# Altium project Motherboard.PrjPcb
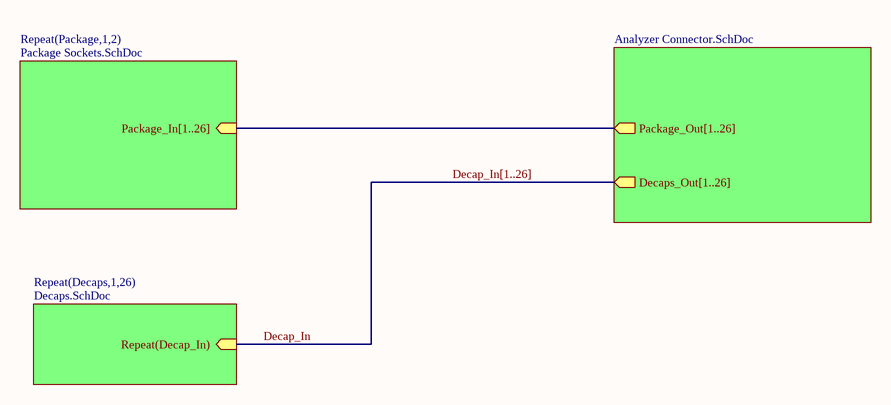
[diagram p0: Main.SchDoc]
5 sheets, 135 parts. Net scope: hierarchical (ports join the sheet entries above them; power ports are global).
Board file: Motherboard.PcbDoc
Sheets:
  Main.SchDoc
    Package1 = Package Sockets.SchDoc
      Resistors1 = Resistors.SchDoc
      Resistors2 = Resistors.SchDoc
      Resistors3 = Resistors.SchDoc
      Resistors4 = Resistors.SchDoc
      Resistors5 = Resistors.SchDoc
      Resistors6 = Resistors.SchDoc
      Resistors7 = Resistors.SchDoc
      Resistors8 = Resistors.SchDoc
      Resistors9 = Resistors.SchDoc
      Resistors10 = Resistors.SchDoc
      Resistors11 = Resistors.SchDoc
      Resistors12 = Resistors.SchDoc
      Resistors13 = Resistors.SchDoc
      Resistors14 = Resistors.SchDoc
      Resistors15 = Resistors.SchDoc
      Resistors16 = Resistors.SchDoc
      Resistors17 = Resistors.SchDoc
      Resistors18 = Resistors.SchDoc
      Resistors19 = Resistors.SchDoc
      Resistors20 = Resistors.SchDoc
      Resistors21 = Resistors.SchDoc
      Resistors22 = Resistors.SchDoc
      Resistors23 = Resistors.SchDoc
      Resistors24 = Resistors.SchDoc
      Resistors25 = Resistors.SchDoc
      Resistors26 = Resistors.SchDoc
    Package2 = Package Sockets.SchDoc
      Resistors1 = Resistors.SchDoc
      Resistors2 = Resistors.SchDoc
      Resistors3 = Resistors.SchDoc
      Resistors4 = Resistors.SchDoc
      Resistors5 = Resistors.SchDoc
      Resistors6 = Resistors.SchDoc
      Resistors7 = Resistors.SchDoc
      Resistors8 = Resistors.SchDoc
      Resistors9 = Resistors.SchDoc
      Resistors10 = Resistors.SchDoc
      Resistors11 = Resistors.SchDoc
      Resistors12 = Resistors.SchDoc
      Resistors13 = Resistors.SchDoc
      Resistors14 = Resistors.SchDoc
      Resistors15 = Resistors.SchDoc
      Resistors16 = Resistors.SchDoc
      Resistors17 = Resistors.SchDoc
      Resistors18 = Resistors.SchDoc
      Resistors19 = Resistors.SchDoc
      Resistors20 = Resistors.SchDoc
      Resistors21 = Resistors.SchDoc
      Resistors22 = Resistors.SchDoc
      Resistors23 = Resistors.SchDoc
      Resistors24 = Resistors.SchDoc
      Resistors25 = Resistors.SchDoc
      Resistors26 = Resistors.SchDoc
     = Analyzer Connector.SchDoc
    Decaps1 = Decaps.SchDoc
    Decaps2 = Decaps.SchDoc
    Decaps3 = Decaps.SchDoc
    Decaps4 = Decaps.SchDoc
    Decaps5 = Decaps.SchDoc
    Decaps6 = Decaps.SchDoc
    Decaps7 = Decaps.SchDoc
    Decaps8 = Decaps.SchDoc
    Decaps9 = Decaps.SchDoc
    Decaps10 = Decaps.SchDoc
    Decaps11 = Decaps.SchDoc
    Decaps12 = Decaps.SchDoc
    Decaps13 = Decaps.SchDoc
    Decaps14 = Decaps.SchDoc
    Decaps15 = Decaps.SchDoc
    Decaps16 = Decaps.SchDoc
    Decaps17 = Decaps.SchDoc
    Decaps18 = Decaps.SchDoc
    Decaps19 = Decaps.SchDoc
    Decaps20 = Decaps.SchDoc
    Decaps21 = Decaps.SchDoc
    Decaps22 = Decaps.SchDoc
    Decaps23 = Decaps.SchDoc
    Decaps24 = Decaps.SchDoc
    Decaps25 = Decaps.SchDoc
    Decaps26 = Decaps.SchDoc

## Sheet Main.SchDoc
size A; SheetNumber: 1; SheetTotal: 5

### Sub-sheets
Repeat(Decaps,1,26) = Decaps.SchDoc: Repeat(Decap_In) (in)
Repeat(Package,1,2) = Package Sockets.SchDoc: Package_In[1..26] (in)
? = Analyzer Connector.SchDoc: Package_Out[1..26] (out), Decaps_Out[1..26] (out)

### Buses and harness runs
bus Decap_In[1..26] = sheet /Decaps_Out[1..26]
bus sheet /Package_Out[1..26] = sheet Repeat(Package,1,2)/Package_In[1..26]

## Sheet Package Sockets.SchDoc
size A; SheetNumber: 3; SheetTotal: 5
Used 2 times, as channels Package1, Package2. Parts and nets are listed once, with the designators drawn on the sheet.
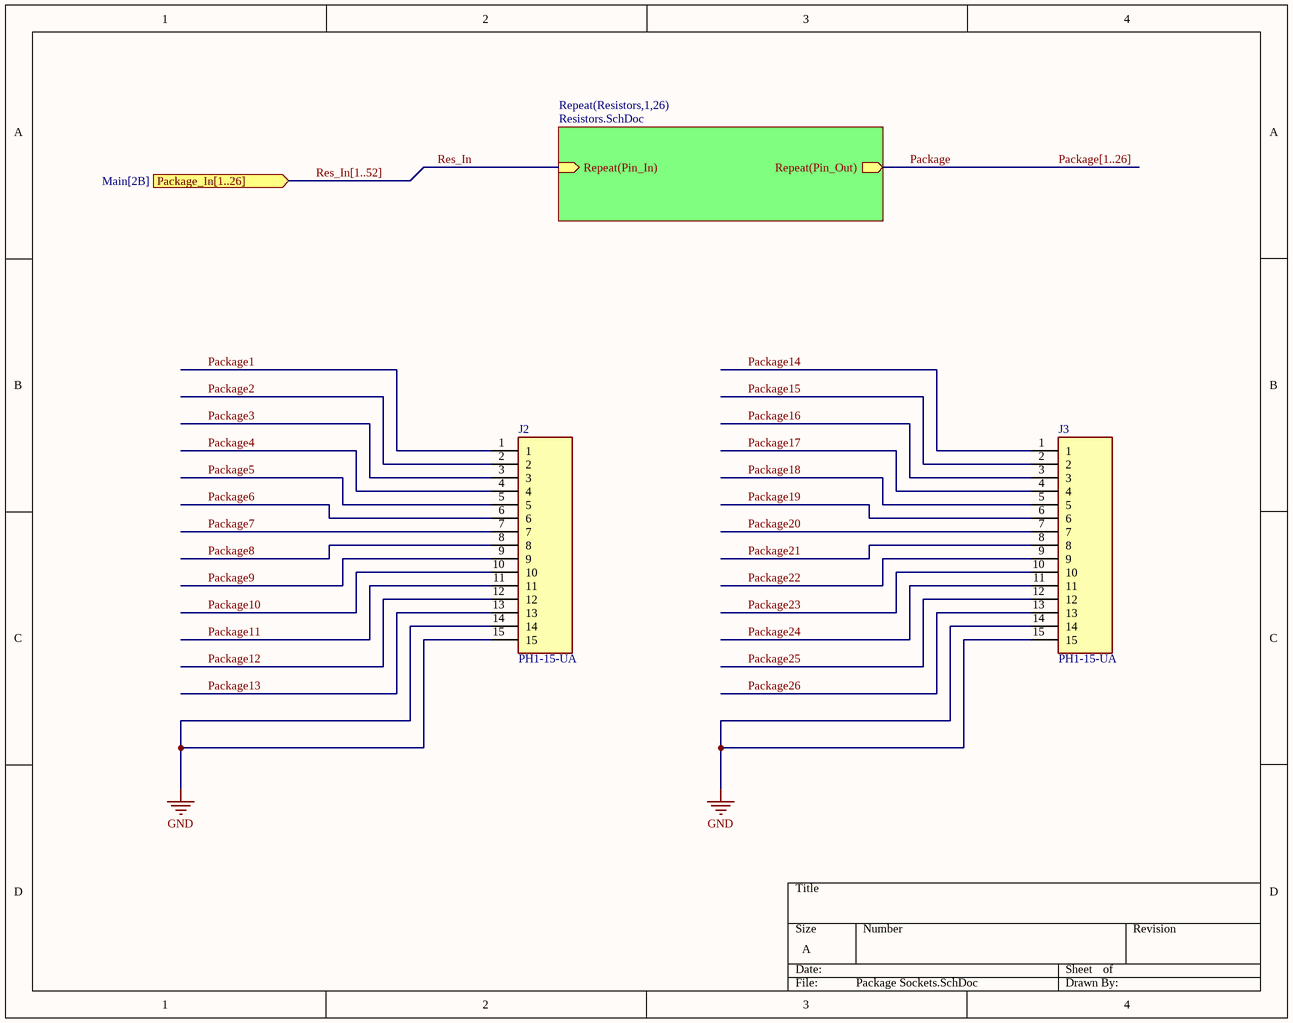
[diagram p1: Package Sockets.SchDoc]

### Parts
J2  PH1-15-UA  [HDRV15W64P0X254_1X15_3810X249X886P]
J3  PH1-15-UA  [HDRV15W64P0X254_1X15_3810X249X886P]

### Sub-sheets
Repeat(Resistors,1,26) = Resistors.SchDoc: Repeat(Pin_In) (in), Repeat(Pin_Out) (out)

### Ports
Package_In[1..26] (in, see Main[2B])

### Nets
GND: J2.14 J2.15 J3.14 J3.15
Package: sheet Repeat(Resistors,1,26)/Repeat(Pin_Out)
Package1: J2.1
Package2: J2.2
Package3: J2.3
Package4: J2.4
Package5: J2.5
Package6: J2.6
Package7: J2.7
Package8: J2.8
Package9: J2.9
Package10: J2.10
Package11: J2.11
Package12: J2.12
Package13: J2.13
Package14: J3.1
Package15: J3.2
Package16: J3.3
Package17: J3.4
Package18: J3.5
Package19: J3.6
Package20: J3.7
Package21: J3.8
Package22: J3.9
Package23: J3.10
Package24: J3.11
Package25: J3.12
Package26: J3.13
Res_In: sheet Repeat(Resistors,1,26)/Repeat(Pin_In)

### Channels
Package1: designators end in _Package1
Package2: designators end in _Package2

### Buses and harness runs
bus Package[1..26]
bus Res_In[1..52] = port Package_In[1..26]

### Library data of the parts
J2 J3 = PH1-15-UA: Connector; Manufacturer_Name: Adam Tech; Datasheet Link: https://app.adam-tech.com/products/download/data_sheet/201605/ph1-xx-ua-data-sheet.pdf; Height: 8.865mm; Manufacturer_Part_Number: PH1-15-UA; Mouser Part Number: 737-PH1-15-UA; Mouser Price/Stock: https://www.mouser.co.uk/ProductDetail/Adam-Tech/PH1-15-UA?qs=HoCaDK9Nz5dUS47ZXPBTBg%3D%3D; Arrow Part Number: PH1-15-UA; Arrow Price/Stock: https://www.arrow.com/en/products/ph1-15-ua/adam-tech?region=nac

## Sheet Resistors.SchDoc
size A; SheetNumber: 4; SheetTotal: 5
Used 52 times, as channels Package1/Resistors1, Package1/Resistors2, Package1/Resistors3, Package1/Resistors4, Package1/Resistors5, Package1/Resistors6, Package1/Resistors7, Package1/Resistors8, Package1/Resistors9, Package1/Resistors10, Package1/Resistors11, Package1/Resistors12, Package1/Resistors13, Package1/Resistors14, Package1/Resistors15, Package1/Resistors16, Package1/Resistors17, Package1/Resistors18, Package1/Resistors19, Package1/Resistors20, Package1/Resistors21, Package1/Resistors22, Package1/Resistors23, Package1/Resistors24, Package1/Resistors25, Package1/Resistors26, Package2/Resistors1, Package2/Resistors2, Package2/Resistors3, Package2/Resistors4, Package2/Resistors5, Package2/Resistors6, Package2/Resistors7, Package2/Resistors8, Package2/Resistors9, Package2/Resistors10, Package2/Resistors11, Package2/Resistors12, Package2/Resistors13, Package2/Resistors14, Package2/Resistors15, Package2/Resistors16, Package2/Resistors17, Package2/Resistors18, Package2/Resistors19, Package2/Resistors20, Package2/Resistors21, Package2/Resistors22, Package2/Resistors23, Package2/Resistors24, Package2/Resistors25, Package2/Resistors26. Parts and nets are listed once, with the designators drawn on the sheet.
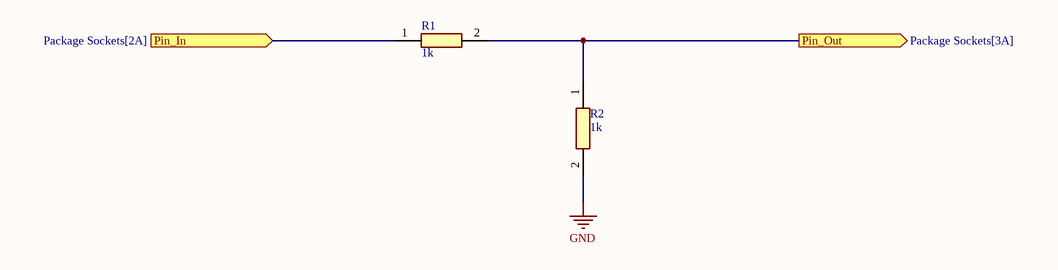
[diagram p2: Resistors.SchDoc]

### Parts
R1  1k  [RESC1608X55N]
R2  1k  [RESC1608X55N]

### Ports
Pin_In (in, see Package Sockets[2A]), Pin_Out (out, see Package Sockets[3A])

### Nets
GND: R2.2
Pin_In: R1.1 ; port Pin_In
Pin_Out: R1.2 R2.1 ; port Pin_Out

### Channels
Package1/Resistors1: designators end in _Resistors1; ports Pin_In=Decap_In1 Pin_Out=Package1_Package1
Package1/Resistors2: designators end in _Resistors2; ports Pin_In=Decap_In2 Pin_Out=Package2_Package1
Package1/Resistors3: designators end in _Resistors3; ports Pin_In=Decap_In3 Pin_Out=Package3_Package1
Package1/Resistors4: designators end in _Resistors4; ports Pin_In=Decap_In4 Pin_Out=Package4_Package1
Package1/Resistors5: designators end in _Resistors5; ports Pin_In=Decap_In5 Pin_Out=Package5_Package1
Package1/Resistors6: designators end in _Resistors6; ports Pin_In=Decap_In6 Pin_Out=Package6_Package1
Package1/Resistors7: designators end in _Resistors7; ports Pin_In=Decap_In7 Pin_Out=Package7_Package1
Package1/Resistors8: designators end in _Resistors8; ports Pin_In=Decap_In8 Pin_Out=Package8_Package1
Package1/Resistors9: designators end in _Resistors9; ports Pin_In=Decap_In9 Pin_Out=Package9_Package1
Package1/Resistors10: designators end in _Resistors10; ports Pin_In=Decap_In10 Pin_Out=Package10_Package1
Package1/Resistors11: designators end in _Resistors11; ports Pin_In=Decap_In11 Pin_Out=Package11_Package1
Package1/Resistors12: designators end in _Resistors12; ports Pin_In=Decap_In12 Pin_Out=Package12_Package1
Package1/Resistors13: designators end in _Resistors13; ports Pin_In=Decap_In13 Pin_Out=Package13_Package1
Package1/Resistors14: designators end in _Resistors14; ports Pin_In=Decap_In14 Pin_Out=Package14_Package1
Package1/Resistors15: designators end in _Resistors15; ports Pin_In=Decap_In15 Pin_Out=Package15_Package1
Package1/Resistors16: designators end in _Resistors16; ports Pin_In=Decap_In16 Pin_Out=Package16_Package1
Package1/Resistors17: designators end in _Resistors17; ports Pin_In=Decap_In17 Pin_Out=Package17_Package1
Package1/Resistors18: designators end in _Resistors18; ports Pin_In=Decap_In18 Pin_Out=Package18_Package1
Package1/Resistors19: designators end in _Resistors19; ports Pin_In=Decap_In19 Pin_Out=Package19_Package1
Package1/Resistors20: designators end in _Resistors20; ports Pin_In=Decap_In20 Pin_Out=Package20_Package1
Package1/Resistors21: designators end in _Resistors21; ports Pin_In=Decap_In21 Pin_Out=Package21_Package1
Package1/Resistors22: designators end in _Resistors22; ports Pin_In=Decap_In22 Pin_Out=Package22_Package1
Package1/Resistors23: designators end in _Resistors23; ports Pin_In=Decap_In23 Pin_Out=Package23_Package1
Package1/Resistors24: designators end in _Resistors24; ports Pin_In=Decap_In24 Pin_Out=Package24_Package1
Package1/Resistors25: designators end in _Resistors25; ports Pin_In=Decap_In25 Pin_Out=Package25_Package1
Package1/Resistors26: designators end in _Resistors26; ports Pin_In=Decap_In26 Pin_Out=Package26_Package1
Package2/Resistors1: designators end in _Resistors27; ports Pin_In=Decap_In1 Pin_Out=Package1_Package2
Package2/Resistors2: designators end in _Resistors28; ports Pin_In=Decap_In2 Pin_Out=Package2_Package2
Package2/Resistors3: designators end in _Resistors29; ports Pin_In=Decap_In3 Pin_Out=Package3_Package2
Package2/Resistors4: designators end in _Resistors30; ports Pin_In=Decap_In4 Pin_Out=Package4_Package2
Package2/Resistors5: designators end in _Resistors31; ports Pin_In=Decap_In5 Pin_Out=Package5_Package2
Package2/Resistors6: designators end in _Resistors32; ports Pin_In=Decap_In6 Pin_Out=Package6_Package2
Package2/Resistors7: designators end in _Resistors33; ports Pin_In=Decap_In7 Pin_Out=Package7_Package2
Package2/Resistors8: designators end in _Resistors34; ports Pin_In=Decap_In8 Pin_Out=Package8_Package2
Package2/Resistors9: designators end in _Resistors35; ports Pin_In=Decap_In9 Pin_Out=Package9_Package2
Package2/Resistors10: designators end in _Resistors36; ports Pin_In=Decap_In10 Pin_Out=Package10_Package2
Package2/Resistors11: designators end in _Resistors37; ports Pin_In=Decap_In11 Pin_Out=Package11_Package2
Package2/Resistors12: designators end in _Resistors38; ports Pin_In=Decap_In12 Pin_Out=Package12_Package2
Package2/Resistors13: designators end in _Resistors39; ports Pin_In=Decap_In13 Pin_Out=Package13_Package2
Package2/Resistors14: designators end in _Resistors40; ports Pin_In=Decap_In14 Pin_Out=Package14_Package2
Package2/Resistors15: designators end in _Resistors41; ports Pin_In=Decap_In15 Pin_Out=Package15_Package2
Package2/Resistors16: designators end in _Resistors42; ports Pin_In=Decap_In16 Pin_Out=Package16_Package2
Package2/Resistors17: designators end in _Resistors43; ports Pin_In=Decap_In17 Pin_Out=Package17_Package2
Package2/Resistors18: designators end in _Resistors44; ports Pin_In=Decap_In18 Pin_Out=Package18_Package2
Package2/Resistors19: designators end in _Resistors45; ports Pin_In=Decap_In19 Pin_Out=Package19_Package2
Package2/Resistors20: designators end in _Resistors46; ports Pin_In=Decap_In20 Pin_Out=Package20_Package2
Package2/Resistors21: designators end in _Resistors47; ports Pin_In=Decap_In21 Pin_Out=Package21_Package2
Package2/Resistors22: designators end in _Resistors48; ports Pin_In=Decap_In22 Pin_Out=Package22_Package2
Package2/Resistors23: designators end in _Resistors49; ports Pin_In=Decap_In23 Pin_Out=Package23_Package2
Package2/Resistors24: designators end in _Resistors50; ports Pin_In=Decap_In24 Pin_Out=Package24_Package2
Package2/Resistors25: designators end in _Resistors51; ports Pin_In=Decap_In25 Pin_Out=Package25_Package2
Package2/Resistors26: designators end in _Resistors52; ports Pin_In=Decap_In26 Pin_Out=Package26_Package2

### Library data of the parts
R1 R2 = RMCF0603FT1K00: Manufacturer_Name: Stackpole Electronics; Datasheet Link: https://www.seielect.com/Catalog/SEI-RMCF_RMCP.pdf; Height: 0.55mm; Manufacturer_Part_Number: RMCF0603FT1K00; Mouser Part Number: 708-RMCF0603FT1K00; Mouser Price/Stock: https://www.mouser.co.uk/ProductDetail/SEI-Stackpole/RMCF0603FT1K00?qs=FESYatJ8odI%252BYiPlprc1Pg%3D%3D; Arrow Part Number: RMCF0603FT1K00; Arrow Price/Stock: https://www.arrow.com/en/products/rmcf0603ft1k00/stackpole-electronics?utm_currency=USD&region=nac

## Sheet Analyzer Connector.SchDoc
size A; SheetNumber: 2; SheetTotal: 5
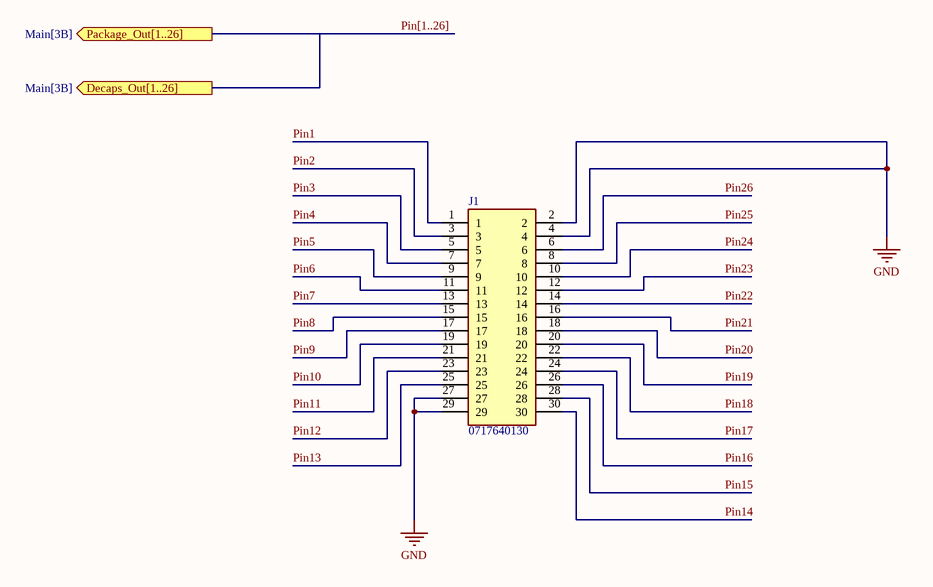
[diagram p3: Analyzer Connector.SchDoc]

### Parts
J1  0717640130  [HDRRA30W64P254_2X15_3810X229X533P]

### Ports
Decaps_Out[1..26] (out, see Main[3B]), Package_Out[1..26] (out, see Main[3B])

### Nets
GND: J1.2 J1.4 J1.27 J1.29
Pin1: J1.1  [project net Decap_In1]
Pin2: J1.3  [project net Decap_In2]
Pin3: J1.5  [project net Decap_In3]
Pin4: J1.7  [project net Decap_In4]
Pin5: J1.9  [project net Decap_In5]
Pin6: J1.11  [project net Decap_In6]
Pin7: J1.13  [project net Decap_In7]
Pin8: J1.15  [project net Decap_In8]
Pin9: J1.17  [project net Decap_In9]
Pin10: J1.19  [project net Decap_In10]
Pin11: J1.21  [project net Decap_In11]
Pin12: J1.23  [project net Decap_In12]
Pin13: J1.25  [project net Decap_In13]
Pin14: J1.30  [project net Decap_In14]
Pin15: J1.28  [project net Decap_In15]
Pin16: J1.26  [project net Decap_In16]
Pin17: J1.24  [project net Decap_In17]
Pin18: J1.22  [project net Decap_In18]
Pin19: J1.20  [project net Decap_In19]
Pin20: J1.18  [project net Decap_In20]
Pin21: J1.16  [project net Decap_In21]
Pin22: J1.14  [project net Decap_In22]
Pin23: J1.12  [project net Decap_In23]
Pin24: J1.10  [project net Decap_In24]
Pin25: J1.8  [project net Decap_In25]
Pin26: J1.6  [project net Decap_In26]

### Buses and harness runs
bus Pin[1..26] = port Decaps_Out[1..26] = port Package_Out[1..26]

### Library data of the parts
J1 = 0717640130: Connector; Manufacturer_Name: Molex; Datasheet Link: https://www.molex.com/pdm_docs/sd/717640130_sd.pdf; Height: 5.33mm; Manufacturer_Part_Number: 0717640130; Mouser Part Number: N/A; Mouser Price/Stock: https://www.mouser.com/Search/Refine.aspx?Keyword=N%2FA; Arrow Part Number: 0717640130; Arrow Price/Stock: https://www.arrow.com/en/products/0717640130/molex

## Sheet Decaps.SchDoc
size A; SheetNumber: 5; SheetTotal: 5
Used 26 times, as channels Decaps1, Decaps2, Decaps3, Decaps4, Decaps5, Decaps6, Decaps7, Decaps8, Decaps9, Decaps10, Decaps11, Decaps12, Decaps13, Decaps14, Decaps15, Decaps16, Decaps17, Decaps18, Decaps19, Decaps20, Decaps21, Decaps22, Decaps23, Decaps24, Decaps25, Decaps26. Parts and nets are listed once, with the designators drawn on the sheet.
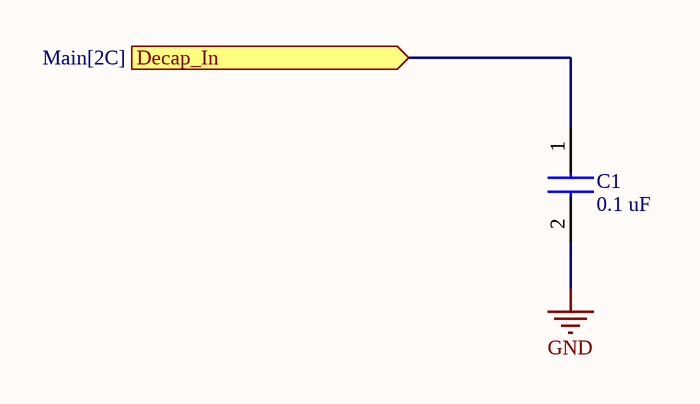
[diagram p4: Decaps.SchDoc]

### Parts
C1  0.1 uF  [C0603]

### Ports
Decap_In (in, see Main[2C])

### Nets
GND: C1.2
Decap_In: C1.1 ; port Decap_In

### Channels
Decaps1: designators end in _Decaps1; ports Decap_In=Decap_In1
Decaps2: designators end in _Decaps2; ports Decap_In=Decap_In2
Decaps3: designators end in _Decaps3; ports Decap_In=Decap_In3
Decaps4: designators end in _Decaps4; ports Decap_In=Decap_In4
Decaps5: designators end in _Decaps5; ports Decap_In=Decap_In5
Decaps6: designators end in _Decaps6; ports Decap_In=Decap_In6
Decaps7: designators end in _Decaps7; ports Decap_In=Decap_In7
Decaps8: designators end in _Decaps8; ports Decap_In=Decap_In8
Decaps9: designators end in _Decaps9; ports Decap_In=Decap_In9
Decaps10: designators end in _Decaps10; ports Decap_In=Decap_In10
Decaps11: designators end in _Decaps11; ports Decap_In=Decap_In11
Decaps12: designators end in _Decaps12; ports Decap_In=Decap_In12
Decaps13: designators end in _Decaps13; ports Decap_In=Decap_In13
Decaps14: designators end in _Decaps14; ports Decap_In=Decap_In14
Decaps15: designators end in _Decaps15; ports Decap_In=Decap_In15
Decaps16: designators end in _Decaps16; ports Decap_In=Decap_In16
Decaps17: designators end in _Decaps17; ports Decap_In=Decap_In17
Decaps18: designators end in _Decaps18; ports Decap_In=Decap_In18
Decaps19: designators end in _Decaps19; ports Decap_In=Decap_In19
Decaps20: designators end in _Decaps20; ports Decap_In=Decap_In20
Decaps21: designators end in _Decaps21; ports Decap_In=Decap_In21
Decaps22: designators end in _Decaps22; ports Decap_In=Decap_In22
Decaps23: designators end in _Decaps23; ports Decap_In=Decap_In23
Decaps24: designators end in _Decaps24; ports Decap_In=Decap_In24
Decaps25: designators end in _Decaps25; ports Decap_In=Decap_In25
Decaps26: designators end in _Decaps26; ports Decap_In=Decap_In26

### Library data of the parts
C1 = C0603C104K5RAC7411: Manufacturer_Name: KEMET; Datasheet Link: https://content.kemet.com/datasheets/KEM_C1002_X7R_SMD.pdf; Height: 0.87mm; Manufacturer_Part_Number: C0603C104K5RAC7411; Mouser Part Number: 80-C0603C104K5R7411; Mouser Price/Stock: https://www.mouser.co.uk/ProductDetail/KEMET/C0603C104K5RAC7411?qs=JxH5GSBHSCRTO9iUpWbJFg%3D%3D; Arrow Part Number: C0603C104K5RAC7411; Arrow Price/Stock: https://www.arrow.com/en/products/c0603c104k5rac7411/kemet-corporation?region=nac

## Nets that join several sheets
GND: Package1 (J2_Package1.14 J2_Package1.15 J3_Package1.14 J3_Package1.15), Package1/Resistors1 (R2_Resistors1.2), Package1/Resistors2 (R2_Resistors2.2), Package1/Resistors3 (R2_Resistors3.2), Package1/Resistors4 (R2_Resistors4.2), Package1/Resistors5 (R2_Resistors5.2), Package1/Resistors6 (R2_Resistors6.2), Package1/Resistors7 (R2_Resistors7.2), Package1/Resistors8 (R2_Resistors8.2), Package1/Resistors9 (R2_Resistors9.2), Package1/Resistors10 (R2_Resistors10.2), Package1/Resistors11 (R2_Resistors11.2), Package1/Resistors12 (R2_Resistors12.2), Package1/Resistors13 (R2_Resistors13.2), Package1/Resistors14 (R2_Resistors14.2), Package1/Resistors15 (R2_Resistors15.2), Package1/Resistors16 (R2_Resistors16.2), Package1/Resistors17 (R2_Resistors17.2), Package1/Resistors18 (R2_Resistors18.2), Package1/Resistors19 (R2_Resistors19.2), Package1/Resistors20 (R2_Resistors20.2), Package1/Resistors21 (R2_Resistors21.2), Package1/Resistors22 (R2_Resistors22.2), Package1/Resistors23 (R2_Resistors23.2), Package1/Resistors24 (R2_Resistors24.2), Package1/Resistors25 (R2_Resistors25.2), Package1/Resistors26 (R2_Resistors26.2), Package2 (J2_Package2.14 J2_Package2.15 J3_Package2.14 J3_Package2.15), Package2/Resistors1 (R2_Resistors27.2), Package2/Resistors2 (R2_Resistors28.2), Package2/Resistors3 (R2_Resistors29.2), Package2/Resistors4 (R2_Resistors30.2), Package2/Resistors5 (R2_Resistors31.2), Package2/Resistors6 (R2_Resistors32.2), Package2/Resistors7 (R2_Resistors33.2), Package2/Resistors8 (R2_Resistors34.2), Package2/Resistors9 (R2_Resistors35.2), Package2/Resistors10 (R2_Resistors36.2), Package2/Resistors11 (R2_Resistors37.2), Package2/Resistors12 (R2_Resistors38.2), Package2/Resistors13 (R2_Resistors39.2), Package2/Resistors14 (R2_Resistors40.2), Package2/Resistors15 (R2_Resistors41.2), Package2/Resistors16 (R2_Resistors42.2), Package2/Resistors17 (R2_Resistors43.2), Package2/Resistors18 (R2_Resistors44.2), Package2/Resistors19 (R2_Resistors45.2), Package2/Resistors20 (R2_Resistors46.2), Package2/Resistors21 (R2_Resistors47.2), Package2/Resistors22 (R2_Resistors48.2), Package2/Resistors23 (R2_Resistors49.2), Package2/Resistors24 (R2_Resistors50.2), Package2/Resistors25 (R2_Resistors51.2), Package2/Resistors26 (R2_Resistors52.2), Analyzer Connector (J1.2 J1.4 J1.27 J1.29), Decaps1 (C1_Decaps1.2), Decaps2 (C1_Decaps2.2), Decaps3 (C1_Decaps3.2), Decaps4 (C1_Decaps4.2), Decaps5 (C1_Decaps5.2), Decaps6 (C1_Decaps6.2), Decaps7 (C1_Decaps7.2), Decaps8 (C1_Decaps8.2), Decaps9 (C1_Decaps9.2), Decaps10 (C1_Decaps10.2), Decaps11 (C1_Decaps11.2), Decaps12 (C1_Decaps12.2), Decaps13 (C1_Decaps13.2), Decaps14 (C1_Decaps14.2), Decaps15 (C1_Decaps15.2), Decaps16 (C1_Decaps16.2), Decaps17 (C1_Decaps17.2), Decaps18 (C1_Decaps18.2), Decaps19 (C1_Decaps19.2), Decaps20 (C1_Decaps20.2), Decaps21 (C1_Decaps21.2), Decaps22 (C1_Decaps22.2), Decaps23 (C1_Decaps23.2), Decaps24 (C1_Decaps24.2), Decaps25 (C1_Decaps25.2), Decaps26 (C1_Decaps26.2)
Decap_In1: Package1/Resistors1 (R1_Resistors1.1), Package2/Resistors1 (R1_Resistors27.1), Analyzer Connector (J1.1), Decaps1 (C1_Decaps1.1)
Decap_In2: Package1/Resistors2 (R1_Resistors2.1), Package2/Resistors2 (R1_Resistors28.1), Analyzer Connector (J1.3), Decaps2 (C1_Decaps2.1)
Decap_In3: Package1/Resistors3 (R1_Resistors3.1), Package2/Resistors3 (R1_Resistors29.1), Analyzer Connector (J1.5), Decaps3 (C1_Decaps3.1)
Decap_In4: Package1/Resistors4 (R1_Resistors4.1), Package2/Resistors4 (R1_Resistors30.1), Analyzer Connector (J1.7), Decaps4 (C1_Decaps4.1)
Decap_In5: Package1/Resistors5 (R1_Resistors5.1), Package2/Resistors5 (R1_Resistors31.1), Analyzer Connector (J1.9), Decaps5 (C1_Decaps5.1)
Decap_In6: Package1/Resistors6 (R1_Resistors6.1), Package2/Resistors6 (R1_Resistors32.1), Analyzer Connector (J1.11), Decaps6 (C1_Decaps6.1)
Decap_In7: Package1/Resistors7 (R1_Resistors7.1), Package2/Resistors7 (R1_Resistors33.1), Analyzer Connector (J1.13), Decaps7 (C1_Decaps7.1)
Decap_In8: Package1/Resistors8 (R1_Resistors8.1), Package2/Resistors8 (R1_Resistors34.1), Analyzer Connector (J1.15), Decaps8 (C1_Decaps8.1)
Decap_In9: Package1/Resistors9 (R1_Resistors9.1), Package2/Resistors9 (R1_Resistors35.1), Analyzer Connector (J1.17), Decaps9 (C1_Decaps9.1)
Decap_In10: Package1/Resistors10 (R1_Resistors10.1), Package2/Resistors10 (R1_Resistors36.1), Analyzer Connector (J1.19), Decaps10 (C1_Decaps10.1)
Decap_In11: Package1/Resistors11 (R1_Resistors11.1), Package2/Resistors11 (R1_Resistors37.1), Analyzer Connector (J1.21), Decaps11 (C1_Decaps11.1)
Decap_In12: Package1/Resistors12 (R1_Resistors12.1), Package2/Resistors12 (R1_Resistors38.1), Analyzer Connector (J1.23), Decaps12 (C1_Decaps12.1)
Decap_In13: Package1/Resistors13 (R1_Resistors13.1), Package2/Resistors13 (R1_Resistors39.1), Analyzer Connector (J1.25), Decaps13 (C1_Decaps13.1)
Decap_In14: Package1/Resistors14 (R1_Resistors14.1), Package2/Resistors14 (R1_Resistors40.1), Analyzer Connector (J1.30), Decaps14 (C1_Decaps14.1)
Decap_In15: Package1/Resistors15 (R1_Resistors15.1), Package2/Resistors15 (R1_Resistors41.1), Analyzer Connector (J1.28), Decaps15 (C1_Decaps15.1)
Decap_In16: Package1/Resistors16 (R1_Resistors16.1), Package2/Resistors16 (R1_Resistors42.1), Analyzer Connector (J1.26), Decaps16 (C1_Decaps16.1)
Decap_In17: Package1/Resistors17 (R1_Resistors17.1), Package2/Resistors17 (R1_Resistors43.1), Analyzer Connector (J1.24), Decaps17 (C1_Decaps17.1)
Decap_In18: Package1/Resistors18 (R1_Resistors18.1), Package2/Resistors18 (R1_Resistors44.1), Analyzer Connector (J1.22), Decaps18 (C1_Decaps18.1)
Decap_In19: Package1/Resistors19 (R1_Resistors19.1), Package2/Resistors19 (R1_Resistors45.1), Analyzer Connector (J1.20), Decaps19 (C1_Decaps19.1)
Decap_In20: Package1/Resistors20 (R1_Resistors20.1), Package2/Resistors20 (R1_Resistors46.1), Analyzer Connector (J1.18), Decaps20 (C1_Decaps20.1)
Decap_In21: Package1/Resistors21 (R1_Resistors21.1), Package2/Resistors21 (R1_Resistors47.1), Analyzer Connector (J1.16), Decaps21 (C1_Decaps21.1)
Decap_In22: Package1/Resistors22 (R1_Resistors22.1), Package2/Resistors22 (R1_Resistors48.1), Analyzer Connector (J1.14), Decaps22 (C1_Decaps22.1)
Decap_In23: Package1/Resistors23 (R1_Resistors23.1), Package2/Resistors23 (R1_Resistors49.1), Analyzer Connector (J1.12), Decaps23 (C1_Decaps23.1)
Decap_In24: Package1/Resistors24 (R1_Resistors24.1), Package2/Resistors24 (R1_Resistors50.1), Analyzer Connector (J1.10), Decaps24 (C1_Decaps24.1)
Decap_In25: Package1/Resistors25 (R1_Resistors25.1), Package2/Resistors25 (R1_Resistors51.1), Analyzer Connector (J1.8), Decaps25 (C1_Decaps25.1)
Decap_In26: Package1/Resistors26 (R1_Resistors26.1), Package2/Resistors26 (R1_Resistors52.1), Analyzer Connector (J1.6), Decaps26 (C1_Decaps26.1)
Package1_Package1: Package1 (J2_Package1.1), Package1/Resistors1 (R1_Resistors1.2 R2_Resistors1.1)
Package1_Package2: Package2 (J2_Package2.1), Package2/Resistors1 (R1_Resistors27.2 R2_Resistors27.1)
Package2_Package1: Package1 (J2_Package1.2), Package1/Resistors2 (R1_Resistors2.2 R2_Resistors2.1)
Package2_Package2: Package2 (J2_Package2.2), Package2/Resistors2 (R1_Resistors28.2 R2_Resistors28.1)
Package3_Package1: Package1 (J2_Package1.3), Package1/Resistors3 (R1_Resistors3.2 R2_Resistors3.1)
Package3_Package2: Package2 (J2_Package2.3), Package2/Resistors3 (R1_Resistors29.2 R2_Resistors29.1)
Package4_Package1: Package1 (J2_Package1.4), Package1/Resistors4 (R1_Resistors4.2 R2_Resistors4.1)
Package4_Package2: Package2 (J2_Package2.4), Package2/Resistors4 (R1_Resistors30.2 R2_Resistors30.1)
Package5_Package1: Package1 (J2_Package1.5), Package1/Resistors5 (R1_Resistors5.2 R2_Resistors5.1)
Package5_Package2: Package2 (J2_Package2.5), Package2/Resistors5 (R1_Resistors31.2 R2_Resistors31.1)
Package6_Package1: Package1 (J2_Package1.6), Package1/Resistors6 (R1_Resistors6.2 R2_Resistors6.1)
Package6_Package2: Package2 (J2_Package2.6), Package2/Resistors6 (R1_Resistors32.2 R2_Resistors32.1)
Package7_Package1: Package1 (J2_Package1.7), Package1/Resistors7 (R1_Resistors7.2 R2_Resistors7.1)
Package7_Package2: Package2 (J2_Package2.7), Package2/Resistors7 (R1_Resistors33.2 R2_Resistors33.1)
Package8_Package1: Package1 (J2_Package1.8), Package1/Resistors8 (R1_Resistors8.2 R2_Resistors8.1)
Package8_Package2: Package2 (J2_Package2.8), Package2/Resistors8 (R1_Resistors34.2 R2_Resistors34.1)
Package9_Package1: Package1 (J2_Package1.9), Package1/Resistors9 (R1_Resistors9.2 R2_Resistors9.1)
Package9_Package2: Package2 (J2_Package2.9), Package2/Resistors9 (R1_Resistors35.2 R2_Resistors35.1)
Package10_Package1: Package1 (J2_Package1.10), Package1/Resistors10 (R1_Resistors10.2 R2_Resistors10.1)
Package10_Package2: Package2 (J2_Package2.10), Package2/Resistors10 (R1_Resistors36.2 R2_Resistors36.1)
Package11_Package1: Package1 (J2_Package1.11), Package1/Resistors11 (R1_Resistors11.2 R2_Resistors11.1)
Package11_Package2: Package2 (J2_Package2.11), Package2/Resistors11 (R1_Resistors37.2 R2_Resistors37.1)
Package12_Package1: Package1 (J2_Package1.12), Package1/Resistors12 (R1_Resistors12.2 R2_Resistors12.1)
Package12_Package2: Package2 (J2_Package2.12), Package2/Resistors12 (R1_Resistors38.2 R2_Resistors38.1)
Package13_Package1: Package1 (J2_Package1.13), Package1/Resistors13 (R1_Resistors13.2 R2_Resistors13.1)
Package13_Package2: Package2 (J2_Package2.13), Package2/Resistors13 (R1_Resistors39.2 R2_Resistors39.1)
Package14_Package1: Package1 (J3_Package1.1), Package1/Resistors14 (R1_Resistors14.2 R2_Resistors14.1)
Package14_Package2: Package2 (J3_Package2.1), Package2/Resistors14 (R1_Resistors40.2 R2_Resistors40.1)
Package15_Package1: Package1 (J3_Package1.2), Package1/Resistors15 (R1_Resistors15.2 R2_Resistors15.1)
Package15_Package2: Package2 (J3_Package2.2), Package2/Resistors15 (R1_Resistors41.2 R2_Resistors41.1)
Package16_Package1: Package1 (J3_Package1.3), Package1/Resistors16 (R1_Resistors16.2 R2_Resistors16.1)
Package16_Package2: Package2 (J3_Package2.3), Package2/Resistors16 (R1_Resistors42.2 R2_Resistors42.1)
Package17_Package1: Package1 (J3_Package1.4), Package1/Resistors17 (R1_Resistors17.2 R2_Resistors17.1)
Package17_Package2: Package2 (J3_Package2.4), Package2/Resistors17 (R1_Resistors43.2 R2_Resistors43.1)
Package18_Package1: Package1 (J3_Package1.5), Package1/Resistors18 (R1_Resistors18.2 R2_Resistors18.1)
Package18_Package2: Package2 (J3_Package2.5), Package2/Resistors18 (R1_Resistors44.2 R2_Resistors44.1)
Package19_Package1: Package1 (J3_Package1.6), Package1/Resistors19 (R1_Resistors19.2 R2_Resistors19.1)
Package19_Package2: Package2 (J3_Package2.6), Package2/Resistors19 (R1_Resistors45.2 R2_Resistors45.1)
Package20_Package1: Package1 (J3_Package1.7), Package1/Resistors20 (R1_Resistors20.2 R2_Resistors20.1)
Package20_Package2: Package2 (J3_Package2.7), Package2/Resistors20 (R1_Resistors46.2 R2_Resistors46.1)
Package21_Package1: Package1 (J3_Package1.8), Package1/Resistors21 (R1_Resistors21.2 R2_Resistors21.1)
Package21_Package2: Package2 (J3_Package2.8), Package2/Resistors21 (R1_Resistors47.2 R2_Resistors47.1)
Package22_Package1: Package1 (J3_Package1.9), Package1/Resistors22 (R1_Resistors22.2 R2_Resistors22.1)
Package22_Package2: Package2 (J3_Package2.9), Package2/Resistors22 (R1_Resistors48.2 R2_Resistors48.1)
Package23_Package1: Package1 (J3_Package1.10), Package1/Resistors23 (R1_Resistors23.2 R2_Resistors23.1)
Package23_Package2: Package2 (J3_Package2.10), Package2/Resistors23 (R1_Resistors49.2 R2_Resistors49.1)
Package24_Package1: Package1 (J3_Package1.11), Package1/Resistors24 (R1_Resistors24.2 R2_Resistors24.1)
Package24_Package2: Package2 (J3_Package2.11), Package2/Resistors24 (R1_Resistors50.2 R2_Resistors50.1)
Package25_Package1: Package1 (J3_Package1.12), Package1/Resistors25 (R1_Resistors25.2 R2_Resistors25.1)
Package25_Package2: Package2 (J3_Package2.12), Package2/Resistors25 (R1_Resistors51.2 R2_Resistors51.1)
Package26_Package1: Package1 (J3_Package1.13), Package1/Resistors26 (R1_Resistors26.2 R2_Resistors26.1)
Package26_Package2: Package2 (J3_Package2.13), Package2/Resistors26 (R1_Resistors52.2 R2_Resistors52.1)